# Altium schematic sheet Thermometer.SchDoc
size A4
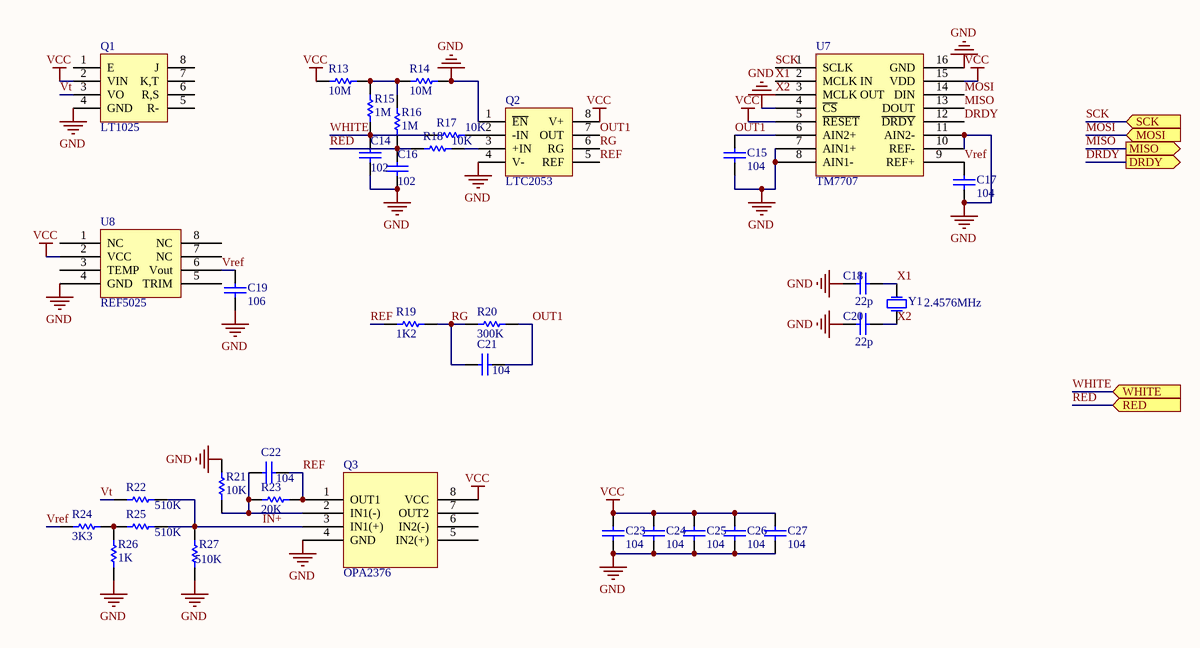
[diagram p0: Thermometer.SchDoc]

## Parts
C14  value 102  [CR2012-0805]  (hidden comment: Cap)
C15  value 104  [CR2012-0805]  (hidden comment: Cap)
C16  value 102  [CR2012-0805]  (hidden comment: Cap)
C17  value 104  [CR2012-0805]  (hidden comment: Cap)
C18  value 22p  [CR2012-0805]  (hidden comment: Cap)
C19  value 106  [CC3216-1206]  (hidden comment: Cap)
C20  value 22p  [CR2012-0805]  (hidden comment: Cap)
C21  value 104  [CR2012-0805]  (hidden comment: Cap)
C22  value 104  [CR2012-0805]  (hidden comment: Cap)
C23  value 104  [CR2012-0805]  (hidden comment: Cap)
C24  value 104  [CR2012-0805]  (hidden comment: Cap)
C25  value 104  [CR2012-0805]  (hidden comment: Cap)
C26  value 104  [CR2012-0805]  (hidden comment: Cap)
C27  value 104  [CR2012-0805]  (hidden comment: Cap)
Q1  LT1025  [SO-G8]
Q2  LTC2053  [MSOP-8]
Q3  OPA2376  [SO-G8]
R13  value 10M  [CR2012-0805]  (hidden comment: Res)
R14  value 10M  [CR2012-0805]  (hidden comment: Res)
R15  value 1M  [CR2012-0805]  (hidden comment: Res)
R16  value 1M  [CR2012-0805]  (hidden comment: Res)
R17  value 10K  [CR2012-0805]  (hidden comment: Res)
R18  value 10K  [CR2012-0805]  (hidden comment: Res)
R19  value 1K2  [CR2012-0805]  (hidden comment: Res)
R20  value 300K  [CR2012-0805]  (hidden comment: Res)
R21  value 10K  [CR2012-0805]  (hidden comment: Res)
R22  value 510K  [CR2012-0805]  (hidden comment: Res)
R23  value 20K  [CR2012-0805]  (hidden comment: Res)
R24  value 3K3  [CR2012-0805]  (hidden comment: Res)
R25  value 510K  [CR2012-0805]  (hidden comment: Res)
R26  value 1K  [CR2012-0805]  (hidden comment: Res)
R27  value 510K  [CR2012-0805]  (hidden comment: Res)
U7  TM7707  [SO-G16/D10]
U8  REF5025  [SO-G8]
Y1  Frequancy: 2.4576MHz  [XTAL]  (hidden comment: XTAL)

## Ports
DRDY (out), MISO (out), MOSI (in), RED (in), SCK (in), WHITE (in)

## Nets
GND: C14.1 C15.2 C16.1 C17.1 C18.1 C19.1 C20.1 C23.1 C24.1 C25.1 C26.1 C27.1 Q1.4(GND) Q2.1(~{EN}) Q2.4(V-) Q3.4(GND) R14.1 R21.2 R26.1 R27.1 U7.4(~{CS}) U7.7(AIN1+) U7.8(AIN1-) U7.10(REF-) U7.11(AIN2-) U7.16(GND) U8.4(GND)
VCC: C23.2 C24.2 C25.2 C26.2 C27.2 Q1.2(VIN) Q2.8(V+) Q3.8(VCC) R13.2 U7.5(~{RESET}) U7.15(VDD) U8.2(VCC)
DRDY: U7.12(~{DRDY}) ; port DRDY
IN+: Q3.3(IN1(+)) R22.2 R25.2 R27.2
MISO: U7.13(DOUT) ; port MISO
MOSI: U7.14(DIN) ; port MOSI
OUT1: C15.1 C21.1 Q2.7(OUT) R20.2 U7.6(AIN2+)
RED: C16.2 R16.1 R18.1 ; port RED
REF: C22.1 Q2.5(REF) Q3.1(OUT1) R19.1 R23.1
RG: C21.2 Q2.6(RG) R19.2 R20.1
SCK: U7.1(SCLK) ; port SCK
Vref: C17.2 C19.2 R24.1 U7.9(REF+) U8.6(Vout)
Vt: Q1.3(VO) R22.1
WHITE: C14.2 R15.1 R17.1 ; port WHITE
X1: C18.2 U7.2(MCLK_IN) Y1.2(OSC2)
X2: C20.2 U7.3(MCLK_OUT) Y1.1(OSC1)
NetC22_2: C22.2 Q3.2(IN1(-)) R21.1 R23.2
NetQ2_2: Q2.2(-IN) R17.2
NetQ2_3: Q2.3(+IN) R18.2
NetR13_1: R13.1 R14.2 R15.2 R16.2
NetR24_2: R24.2 R25.1 R26.2

Not connected (* = marked no-connect by the designer): Q1 1(E) 5(R-) 6(R,S) 7(K,T) 8(J); Q3 5(IN2(+)) 6(IN2(-)) 7(OUT2); U8 1(NC) 3(TEMP) 5(TRIM) 7(NC) 8(NC)

## Library data of the parts
C14-C27 = Cap: Capacitor; Published: 8-Jun-2000; LatestRevisionDate: 17-Jul-2002; LatestRevisionNote: Re-released for DXP Platform.; Publisher: Altium Limited
Q3 = Double_AMP
R13-R27 = Res: Resistor; Published: 8-Jun-2000; LatestRevisionDate: 17-Jul-2002; LatestRevisionNote: Re-released for DXP Platform.; Publisher: Altium Limited
Y1 = XTAL: Crystal Oscillator; Published: 8-Jun-2000; LatestRevisionDate: 17-Jul-2002; LatestRevisionNote: Re-released for DXP Platform.; Publisher: Altium Limited